# Altium schematic sheet RWSv3.SchDoc
size 274 x 210 mm
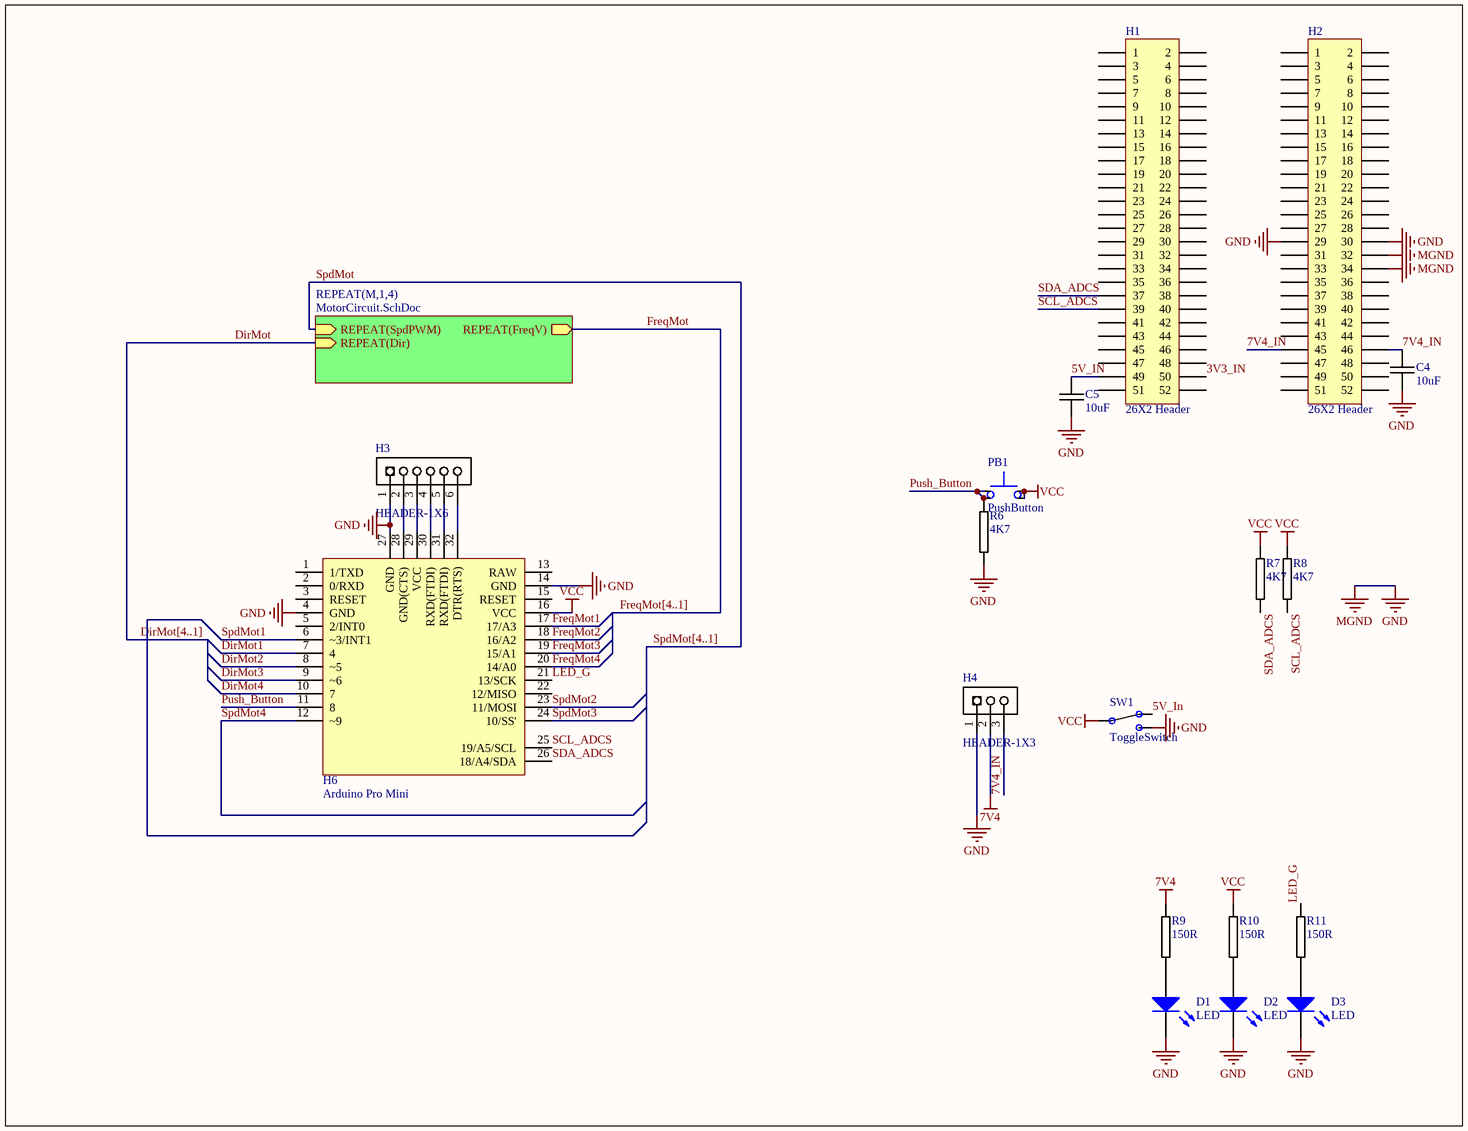
[diagram p0: RWSv3.SchDoc]

## Parts
C4  10uF  [0805C-TBD]
C5  10uF  [0805C-TBD]
D1  LED  [LED]
D2  LED  [LED]
D3  LED  [LED]
H1  26X2 Header  [26X2 Header]
H2  26X2 Header  [26X2 Header]
H3  HEADER-1X6  [HEADER-1X6]
H4  HEADER-1X3  [HEADER-1X3]
H6  Arduino Pro Mini  [Arduino Pro Mini]
PB1  PushButton  [PushButton]
R6  4K7  [0805R-4K7]
R7  4K7  [0805R-4K7]
R8  4K7  [0805R-4K7]
R9  150R  [0805R-150]
R10  150R  [0805R-150]
R11  150R  [0805R-150]
SW1  ToggleSwitch  [SWITCHFOOTPRINT]

## Sub-sheets
REPEAT(M,1,4) = MotorCircuit.SchDoc: REPEAT(SpdPWM) (in), REPEAT(Dir) (in), REPEAT(FreqV) (out)

## Nets
7V4: H4.2 R9.1
GND: C4.2 C5.2 D1.2(K) D2.2(K) D3.2(K) H2.29 H2.30 H2.32 H2.34 H3.1 H4.1 H6.4(GND) H6.14(GND) H6.27(GND) R6.2 SW1.25  [also labelled MGND]
VCC: H6.16(VCC) PB1.27 PB1.29 R7.1 R8.1 R10.1 SW1.23
3V3_IN: H1.50
5V_IN: C5.1 H1.49 SW1.24
7V4_IN: C4.1 H2.45 H2.46 H4.3
DirMot: sheet REPEAT(M,1,4)/REPEAT(Dir)
DirMot1: H6.7(4)
DirMot2: H6.8(~5)
DirMot3: H6.9(~6)
DirMot4: H6.10(7)
FreqMot: sheet REPEAT(M,1,4)/REPEAT(FreqV)
FreqMot1: H6.17(17/A3)
FreqMot2: H6.18(16/A2)
FreqMot3: H6.19(15/A1)
FreqMot4: H6.20(14/A0)
LED_G: H6.21(13/SCK) R11.1
Push_Button: H6.11(8) PB1.26 PB1.28 R6.1
SCL_ADCS: H1.39 H6.25(19/A5/SCL) R8.2
SDA_ADCS: H1.37 H6.26(18/A4/SDA) R7.2
SpdMot: sheet REPEAT(M,1,4)/REPEAT(SpdPWM)
SpdMot1: H6.6(~3/INT1)
SpdMot2: H6.23(11/MOSI)
SpdMot3: H6.24(10/SS')
SpdMot4: H6.12(~9)
NetD1_1: D1.1(A) R9.2
NetD2_1: D2.1(A) R10.2
NetD3_1: D3.1(A) R11.2
NetH3_2: H3.2 H6.28(GND(CTS))
NetH3_3: H3.3 H6.29(VCC)
NetH3_4: H3.4 H6.30(RXD(FTDI))
NetH3_5: H3.5 H6.31(RXD(FTDI))
NetH3_6: H3.6 H6.32(DTR(RTS))

Not connected (* = marked no-connect by the designer): H1 1 2 3 4 5 6 7 8 9 10 11 12 13 14 15 16 17 18 19 20 21 22 23 24 25 26 27 28 29 30 31 32 33 34 35 36 38 40 41 42 43 44 45 46 47 48 51 52; H2 1 2 3 4 5 6 7 8 9 10 11 12 13 14 15 16 17 18 19 20 21 22 23 24 25 26 27 28 31 33 35 36 37 38 39 40 41 42 43 44 47 48 49 50 51 52; H6 1(1/TXD) 2(0/RXD) 3(RESET) 5(2/INT0) 13(RAW) 15(RESET) 22(12/MISO)

## Buses and harness runs
bus DirMot[4..1]
bus FreqMot[4..1]
bus SpdMot[4..1]

## Library data of the parts
C4 C5 = 0805C-100nF-25V-X7R-MUR: CAPACITOR 0805 CERAMIC; Supplier 1: Digi-Key; Supplier Part Number 1: 490-1673-1-ND
D1-D3 = LED: Small LED
PB1 = PushButton: pin to pad: 26>5 27>7 28>6 29>8
R6-R8 = 0805R-4K7: RESISTOR 0805 1/4 WATT THIN FILM; Reel: *
R9-R11 = 0805R-150: RESISTOR 0805 1/4 WATT THIN FILM; Reel: *
SW1 = ToggleSwitch: pin to pad: 23>3 24>2 25>4
H3 = HEADER-1X6: Supplier 1: Digi-Key; Supplier Part Number 1: S1011E-36-ND
H4 = HEADER-1X3: Supplier 1: Digi-Key; Supplier Part Number 1: S1011E-36-ND